# Altium schematic sheet UNO-ESP32.schdoc
size A2
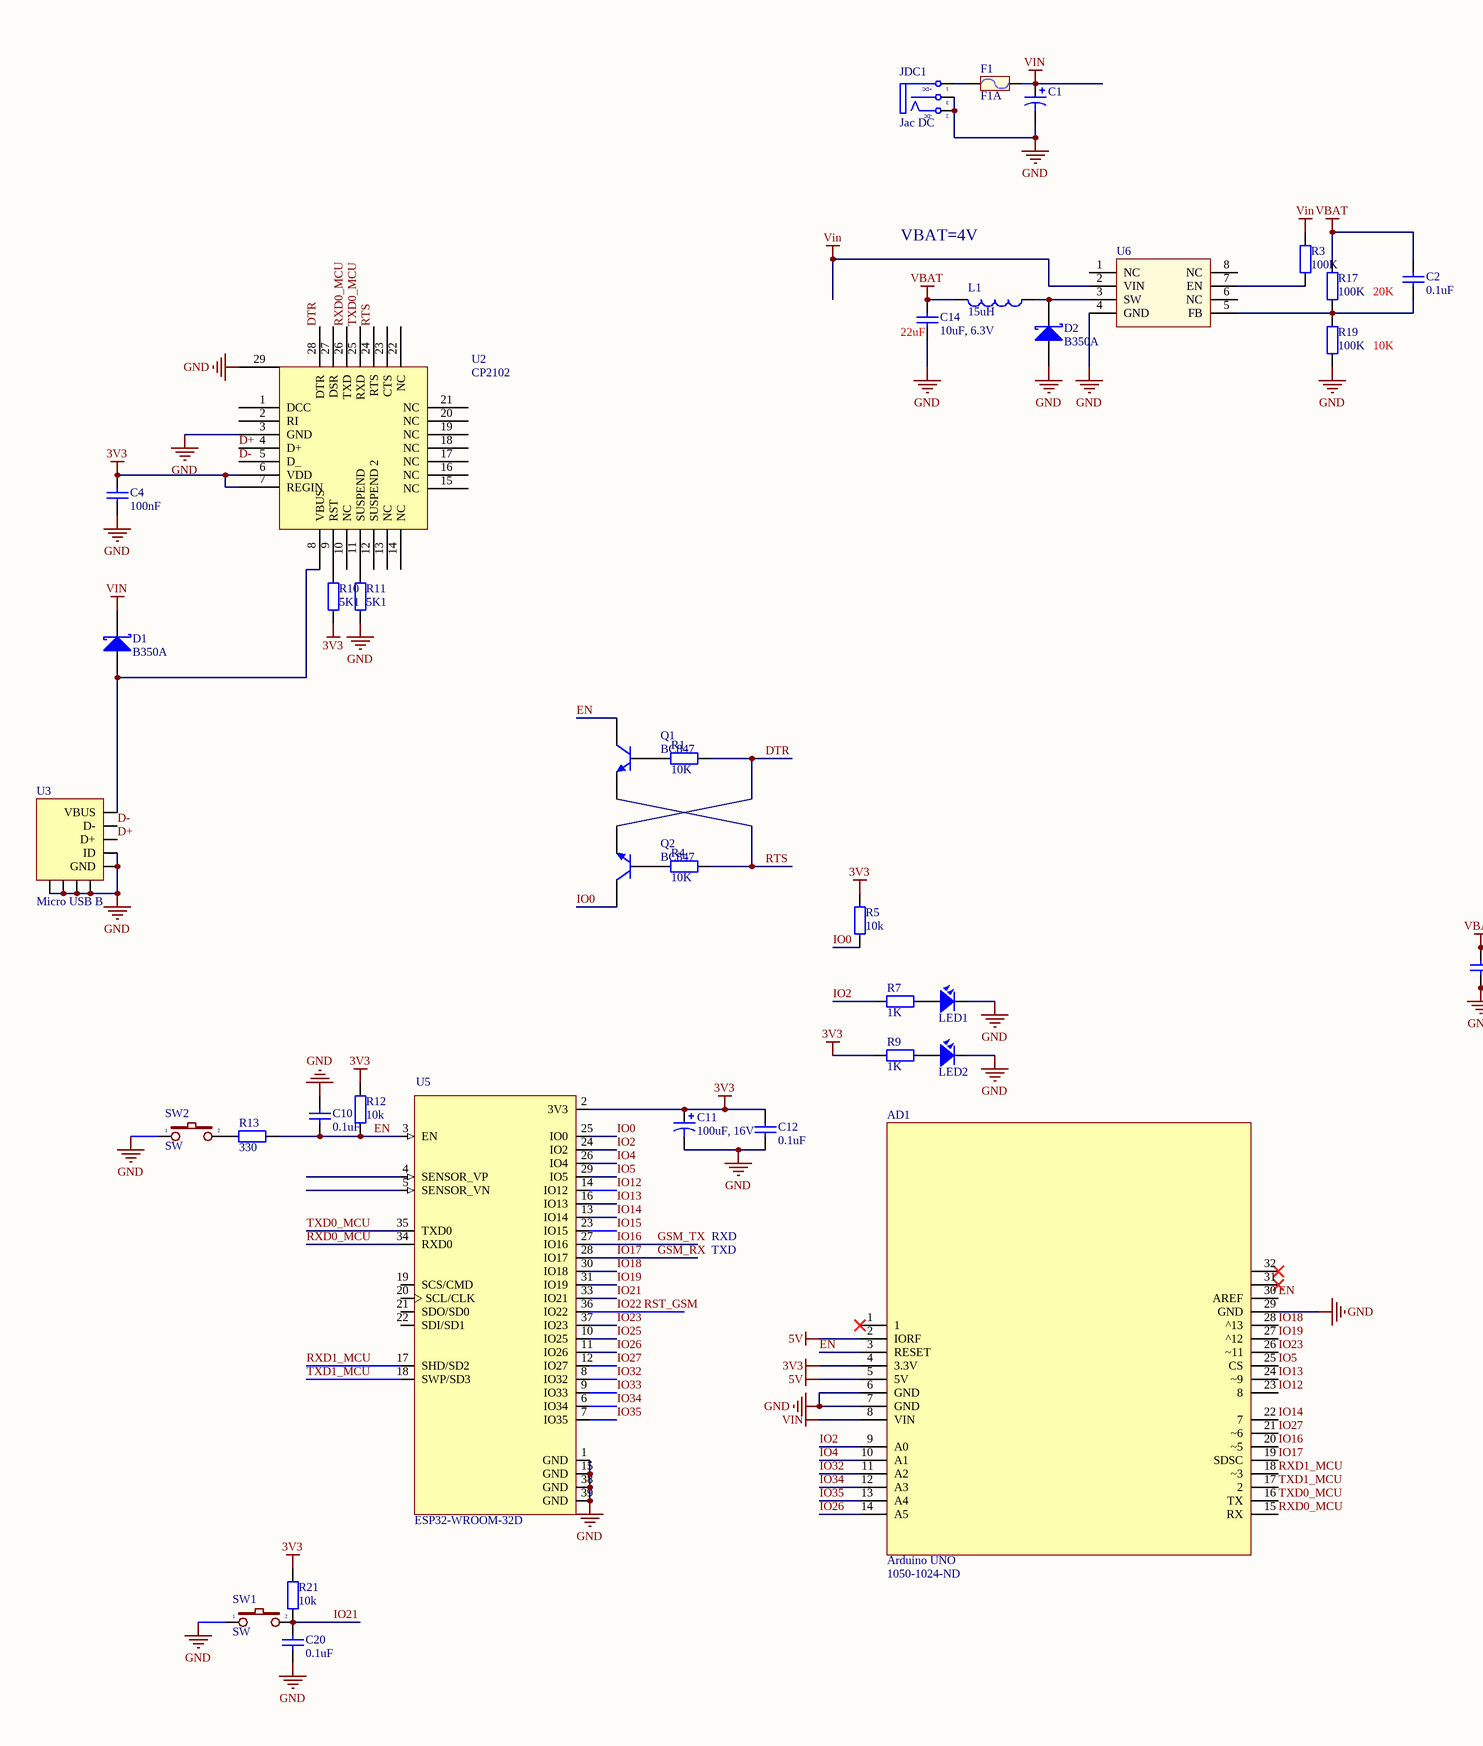
[diagram p0: UNO-ESP32.schdoc, left]
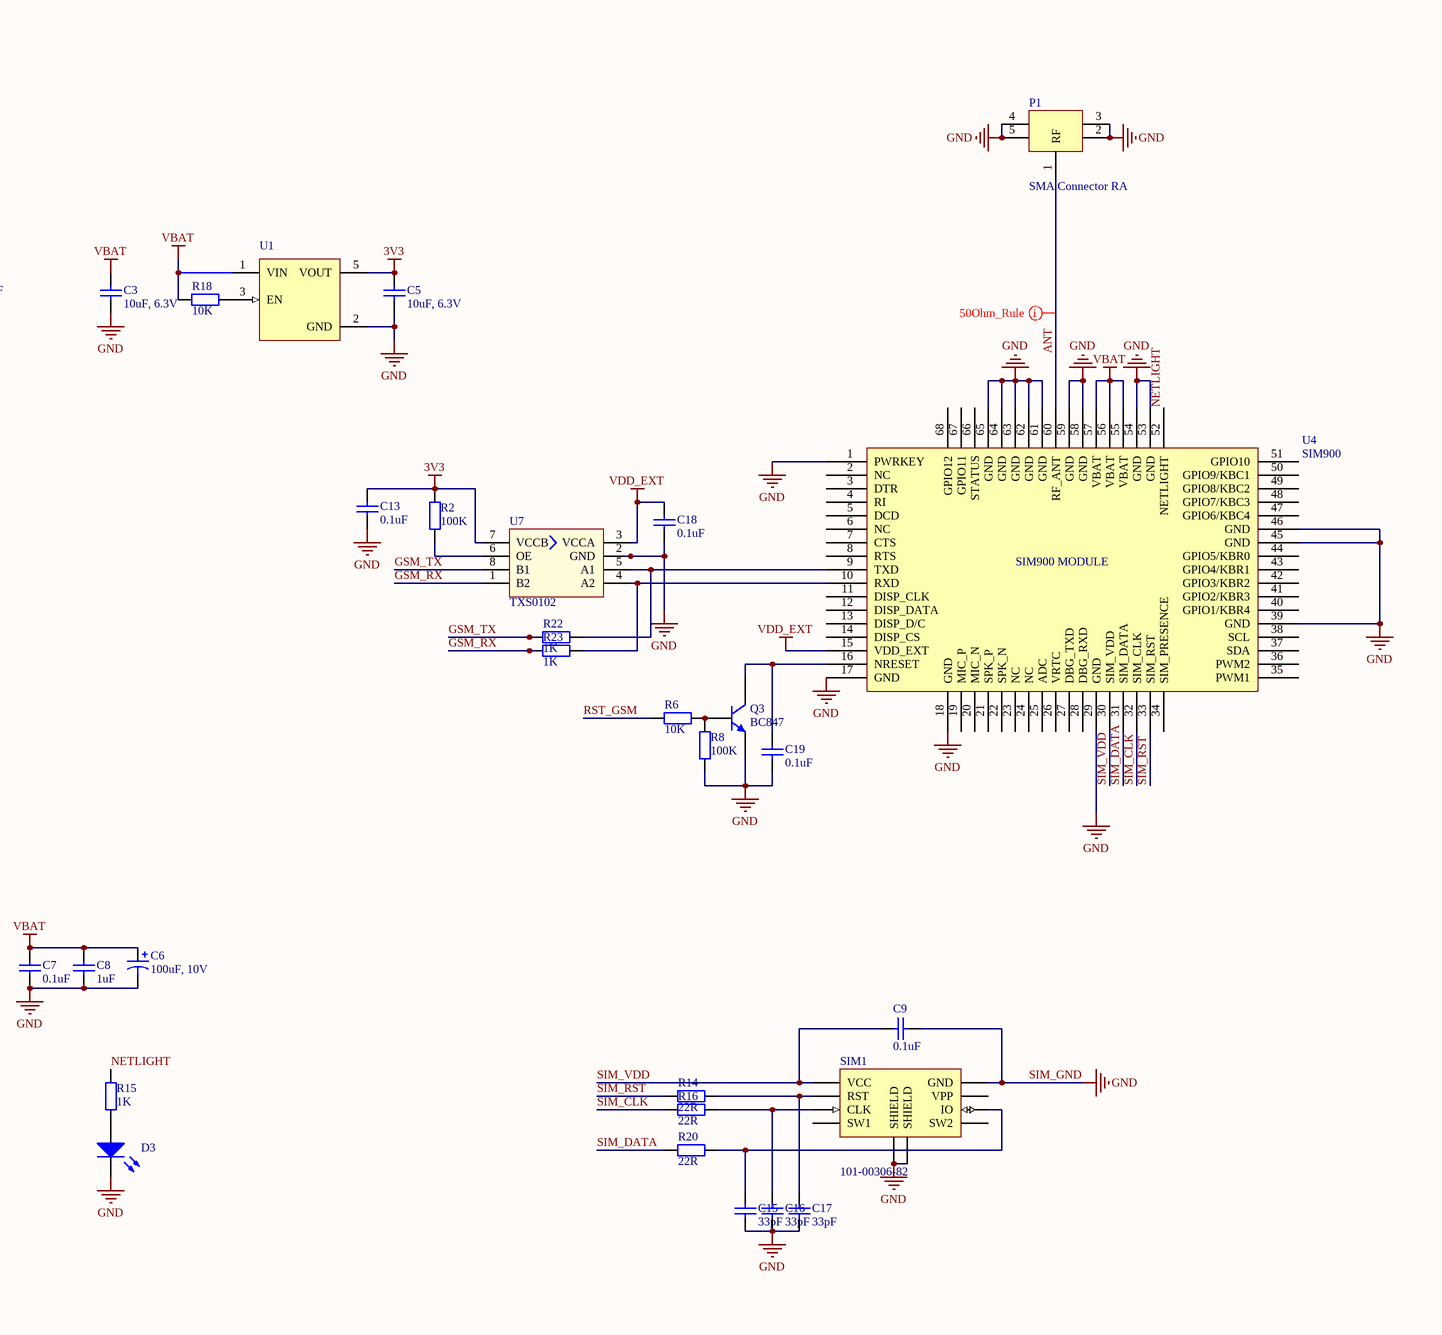
[diagram p1: UNO-ESP32.schdoc, right]

## Parts
AD1  Arduino UNO  Supplier Part Number 1: 1050-1024-ND  [Arduino UNO]
C1  Aluminum Cap 100uF 50V 20%  [CAPACITOR SIZE_E(D8.3)]  (value not drawn)
C2  value 0.1uF  [C0603]  (hidden comment: Ceramic Cap 0603 0.1uF 50V 10% X7R)
C3  value 10uF, 6.3V  [C0603]  (hidden comment: Ceramic Cap 0603 10uF 6.3V 20% X5R)
C4  value 100nF  [C0603]  (hidden comment: Ceramic Cap 0603 4.7UF  6.3V 5% NP0)
C5  value 10uF, 6.3V  [C0603]  (hidden comment: Ceramic Cap 0603 10uF 6.3V 20% X5R)
C6  value 100uF, 10V  [C2917]  (hidden comment: Tantalum Cap 2917 100uF 10V 10% 100 mOhm)
C7  value 0.1uF  [C0603]  (hidden comment: Ceramic Cap 0603 0.1uF 50V 10% X7R)
C8  value 1uF  [C0603]  (hidden comment: Ceramic Cap 0603 1uF 25V 10% X5R)
C9  value 0.1uF  [C0603]  (hidden comment: Ceramic Cap 0603 0.1uF 50V 10% X7R)
C10  value 0.1uF  [C0603]  (hidden comment: Ceramic Cap 0603 0.1uF 50V 10% X7R)
C11  value 100uF, 16V  [C2917]  (hidden comment: 100µF Molded Tantalum Capacitors 16V 2917)
C12  value 0.1uF  [C0603]  (hidden comment: Ceramic Cap 0603 0.1uF 50V 10% X7R)
C13  value 0.1uF  [C0603]  (hidden comment: Ceramic Cap 0603 0.1uF 50V 10% X7R)
C14  value 10uF, 6.3V  [C1812NP]  (hidden comment: Ceramic Cap 0603 10uF 6.3V 20% X5R)
C15  value 33pF  [C0603]  (hidden comment: Ceramic Cap 0603 33pF 50V 5% NP0)
C16  value 33pF  [C0603]  (hidden comment: Ceramic Cap 0603 33pF 50V 5% NP0)
C17  value 33pF  [C0603]  (hidden comment: Ceramic Cap 0603 33pF 50V 5% NP0)
C18  value 0.1uF  [C0603]  (hidden comment: Ceramic Cap 0603 0.1uF 50V 10% X7R)
C19  value 0.1uF  [C0603]  (hidden comment: Ceramic Cap 0603 0.1uF 50V 10% X7R)
C20  value 0.1uF  [C0603]  (hidden comment: Ceramic Cap 0603 0.1uF 50V 10% X7R)
D1  B350A  [DO-214AC]
D2  B350A  [DO-214AC]
D3  LED Green  [LED0603-G]  (value not drawn)
F1  F1A  [FUSE SMD]
JDC1  Jac DC  [DC-IN]
L1  value 15uH  [VLP8940]  (hidden comment: Inductor Shielded 15uH SMD)
LED1  LED  [LED0603-Y]  (value not drawn)
LED2  LED  [LED0603-Y]  (value not drawn)
P1  SMA Connector RA  [SMA R/A]
Q1  BC847  [SOT-23]
Q2  BC847  [SOT-23]
Q3  BC847  [SOT-23]
R1  value 10K  [R0603]  (hidden comment: RES 10K 5% 1/10W 0603)
R2  value 100K  [R0603]  (hidden comment: RES 100K 5% 1/10W 0603)
R3  value 100K  [R0603]  (hidden comment: RES 100K 5% 1/10W 0603)
R4  value 10K  [R0603]  (hidden comment: RES 10K 5% 1/10W 0603)
R5  value 10k  [R0603]  (hidden comment: RES 1K 5% 1/10W 0603)
R6  value 10K  [R0603]  (hidden comment: RES 100K 5% 1/10W 0603)
R7  value 1K  [R0603]  (hidden comment: RES 1K 5% 1/10W 0603)
R8  value 100K  [R0603]  (hidden comment: RES 100K 5% 1/10W 0603)
R9  value 1K  [R0603]  (hidden comment: RES 1K 5% 1/10W 0603)
R10  value 5K1  [R0603]  (hidden comment: RES 1K 5% 1/10W 0603)
R11  value 5K1  [R0603]  (hidden comment: RES 1K 5% 1/10W 0603)
R12  value 10k  [R0603]  (hidden comment: RES 1K 5% 1/10W 0603)
R13  value 330  [R0603]  (hidden comment: RES 1K 5% 1/10W 0603)
R14  value 22R  [R0603]  (hidden comment: RES 22R 5% 1/10W 0603)
R15  value 1K  [R0603]  (hidden comment: RES 1K 5% 1/10W 0603)
R16  value 22R  [R0603]  (hidden comment: RES 22R 5% 1/10W 0603)
R17  value 100K  [R0603]  (hidden comment: RES 100K 5% 1/10W 0603)
R18  value 10K  [R0603]  (hidden comment: RES 100K 5% 1/10W 0603)
R19  value 100K  [R0603]  (hidden comment: RES 100K 5% 1/10W 0603)
R20  value 22R  [R0603]  (hidden comment: RES 22R 5% 1/10W 0603)
R21  value 10k  [R0603]  (hidden comment: RES 1K 5% 1/10W 0603)
R22  value 1K  [R0603]  (hidden comment: RES 1K 5% 1/10W 0603)
R23  value 1K  [R0603]  (hidden comment: RES 1K 5% 1/10W 0603)
SIM1  value 101-00306-82  [nano-sim]  (hidden comment: SIM Card Holder)
SW1  SW  [SW-smd]
SW2  SW  [SW-smd]
U1  AP2112K-3.3TRG1  [SOT-23-5]  (value not drawn)
U2  CP2102  [CP2102]
U3  Micro USB B  [USB Micro B - DIP]
U4  SIM900  [SIM900]
U5  ESP32-WROOM-32D  [*MODULE_ESP32-WROOM-32D]
U6  TD1410  [SO-8]  (value not drawn)
U7  TXS0102  [TXS0102]

## Nets
3V3: AD1.4(3.3V) C4.1 C5.2 C11.1 C12.2 C13.2 R2.2 R5.1 R9.1 R10.1 R12.1 R21.1 U1.5(VOUT) U2.6(VDD) U2.7(REGIN) U5.2(3V3) U7.7(VCCB)
5V: AD1.2(IORF) AD1.5(5V)
SIM_GND: AD1.6(GND) AD1.7(GND) AD1.29(GND) C1.2 C3.1 C4.2 C5.1 C6.2 C7.1 C8.1 C9.1 C10.2 C11.2 C12.1 C13.1 C14.1 C15.1 C16.1 C17.1 C18.1 C19.1 C20.1 D2.1(A) D3.2(K) JDC1.2(TN) JDC1.3(S) LED1.2 LED2.2 P1.2(GND) P1.3(GND) P1.4(GND) P1.5(GND) Q3.2(E) R8.1 R11.1 R19.1 SIM1.C5(GND) SIM1.SHIELD SW1.1 SW2.1 U1.2(GND) U2.3(GND) U2.29 U3.4(ID) U3.5(GND) U3.SHIELD U4.1(PWRKEY) U4.17(GND) U4.18(GND) U4.29(GND) U4.39(GND) U4.45(GND) U4.46(GND) U4.53(GND) U4.54(GND) U4.58(GND) U4.59(GND) U4.61(GND) U4.62(GND) U4.63(GND) U4.64(GND) U4.65(GND) U5.1(GND) U5.15(GND) U5.38(GND) U5.39(GND) U6.4(GND) U7.2(GND)  [also labelled GND]
VBAT: C2.2 C3.2 C6.1 C7.2 C8.2 C14.2 L1.1 R17.2 R18.1 U1.1(VIN) U4.55(VBAT) U4.56(VBAT) U4.57(VBAT)
VDD_EXT: C18.2 U4.15(VDD_EXT) U7.3(VCCA)
VIN: AD1.8(VIN) C1.1 D1.2(K) F1.2 R3.2 U6.2(VIN)
ANT: P1.1(RF) U4.60(RF_ANT)
D+: U2.4(D+) U3.3(D+)
D-: U2.5(D_) U3.2(D-)
DTR: Q2.2(E) R1.1 U2.28(DTR)
EN: AD1.3(RESET) AD1.30(AREF) C10.1 Q1.3(C) R12.2 R13.2 U5.3(EN)
GSM_RX: AD1.19(SDSC) R23.1 U5.28(IO17) U7.1(B2)  [also labelled IO17]
GSM_TX: AD1.20(~5) R22.1 U5.27(IO16) U7.8(B1)  [also labelled IO16]
IO0: Q2.3(C) R5.2 U5.25(IO0)
IO2: AD1.9(A0) R7.1 U5.24(IO2)
IO4: AD1.10(A1) U5.26(IO4)
IO5: AD1.25(CS) U5.29(IO5)
IO12: AD1.23(8) U5.14(IO12)
IO13: AD1.24(~9) U5.16(IO13)
IO14: AD1.22(7) U5.13(IO14)
IO15: U5.23(IO15)
IO18: AD1.28(^13) U5.30(IO18)
IO19: AD1.27(^12) U5.31(IO19)
IO21: C20.2 R21.2 SW1.2 U5.33(IO21)
IO22: R6.1 U5.36(IO22)  [also labelled RST_GSM]
IO23: AD1.26(~11) U5.37(IO23)
IO25: U5.10(IO25)
IO26: AD1.14(A5) U5.11(IO26)
IO27: AD1.21(~6) U5.12(IO27)
IO32: AD1.11(A2) U5.8(IO32)
IO33: U5.9(IO33)
IO34: AD1.12(A3) U5.6(IO34)
IO35: AD1.13(A4) U5.7(IO35)
NETLIGHT: R15.2 U4.52(NETLIGHT)
RTS: Q1.2(E) R4.1 U2.24(RTS)
RXD0_MCU: AD1.15(RX) U2.26(TXD) U5.34(RXD0)
RXD1_MCU: AD1.18(~3) U5.17(SHD/SD2)
SIM_CLK: R16.1 U4.32(SIM_CLK)
SIM_DATA: R20.1 U4.31(SIM_DATA)
SIM_RST: R14.1 U4.33(SIM_RST)
SIM_VDD: C9.2 SIM1.C1(VCC) U4.30(SIM_VDD)
TXD0_MCU: AD1.16(TX) U2.25(RXD) U5.35(TXD0)
TXD1_MCU: AD1.17(2) U5.18(SWP/SD3)
NetC2_1: C2.1 R17.1 R19.2 U6.5(FB)
NetC15_2: C15.2 R20.2 SIM1.C7(IO)
NetC16_2: C16.2 R16.2 SIM1.C3(CLK)
NetC17_2: C17.2 R14.2 SIM1.C2(RST)
NetC19_2: C19.2 Q3.3(C) U4.16(NRESET)
NetD1_1: D1.1(A) U2.8(VBUS) U3.1(VBUS)
NetD2_2: D2.2(K) L1.2 U6.3(SW)
NetD3_1: D3.1(A) R15.1
NetF1_1: F1.1 JDC1.1(T)
NetLED1_1: LED1.1 R7.2
NetLED2_1: LED2.1 R9.2
NetQ1_1: Q1.1(B) R1.2
NetQ2_1: Q2.1(B) R4.2
NetQ3_1: Q3.1(B) R6.2 R8.2
NetR2_1: R2.1 U7.6(OE)
NetR3_1: R3.1 U6.7(EN)
NetR10_2: R10.2 U2.9(RST)
NetR11_2: R11.2 U2.11(SUSPEND)
NetR13_1: R13.1 SW2.2
NetR18_2: R18.2 U1.3(EN)
NetR22_2: R22.2 U4.9(TXD) U7.5(A1)
NetR23_2: R23.2 U4.10(RXD) U7.4(A2)

Not connected (* = marked no-connect by the designer): AD1 1* 31* 32*; SIM1 C6(VPP) SW1 SW2; U2 1(DCC) 2(RI) 10(NC) 12(SUSPEND_2) 13(NC) 14(NC) 15(NC) 16(NC) 17(NC) 18(NC) 19(NC) 20(NC) 21(NC) 22(NC) 23(CTS) 27(DSR); U4 2(NC) 3(DTR) 4(RI) 5(DCD) 6(NC) 7(CTS) 8(RTS) 11(DISP_CLK) 12(DISP_DATA) 13(DISP_D/C) 14(DISP_CS) 19(MIC_P) 20(MIC_N) 21(SPK_P) 22(SPK_N) 23(NC) 24(NC) 25(ADC) 26(VRTC) 27(DBG_TXD) 28(DBG_RXD) 34(SIM_PRESENCE) 35(PWM1) 36(PWM2) 37(SDA) 38(SCL) 40(GPIO1/KBR4) 41(GPIO2/KBR3) 42(GPIO3/KBR2) 43(GPIO4/KBR1) 44(GPIO5/KBR0) 47(GPIO6/KBC4) 48(GPIO7/KBC3) 49(GPIO8/KBC2) 50(GPIO9/KBC1) 51(GPIO10) 66(STATUS) 67(GPIO11) 68(GPIO12); U5 4(SENSOR_VP) 5(SENSOR_VN) 19(SCS/CMD) 20(SCL/CLK) 21(SDO/SD0) 22(SDI/SD1); U6 1(NC) 6(NC) 8(NC)

## Layout directives
rule Width Constraint [Pref Width = 26mil    Min Width = 26mil    Max Width = 26mil]; rule Clearance Constraint [Clearance = 10mil]: ANT

## Notes on the sheet
- VBAT=4V
- (near C2) 20K
- (near C14) 22uF
- 10K
- RXD
- TXD
- (in symbol DCIN) +DC; -DC
- (in symbol SIM900) SIM900 MODULE

## Library data of the parts
C1 = 50ZLJ100MT78X11.5: Rubicon Aluminum Cap 100uF 50V 20%; Supplier Part Number 1: 1189-1662-1-ND; Supplier 1: Digi-Key
C2 C7 C9 C10 C12 C13 C18-C20 = GRM188R71H104KA93: Murata General Purpose Ceramic Cap 0603 0.1uF 50V 10% X7R; Supplier 1: Digi-Key; Supplier Part Number 1: 490-1519-1-ND
C3 C5 C14 = GRM188R60J106ME47: Murata General Purpose Ceramic Cap 0603 10uF 6.3V 20% X5R; Supplier 1: Digi-Key; Supplier Part Number 1: 490-3896-1-ND
C4 = GRM188R61C475KAAJD: CAP CER 4.7UF 6.3V X6S 0603; Supplier 1: Digi-Key; Supplier Part Number 1: 490-10481-2-ND
C6 = TPSD107K010R0100: AVX Tantalum Cap 2917 100uF 10V 10% 100 mOhm; Supplier 1: Digi-Key; Supplier Part Number 1: 478-1777-1-ND
C8 = GRM188R61E105KA12: Murata General Purpose Ceramic Cap 0603 1uF 25V 10% X5R; Supplier 1: Digi-Key; Supplier 2: Digi-Key; Supplier Part Number 1: 490-6414-1-ND; Supplier Part Number 2: 490-3897-1-ND
C11 = TAJD107M016RNJ: 100µF Molded Tantalum Capacitors 16V 2917 (7343 Metric) 600 mOhm 0.287" L x 0.169" W (7.30mm x 4.30mm); Supplier 1: Digi-Key; Supplier Part Number 1: 478-3919-2-ND
C15-C17 = GRM1885C1H330JA01: Murata General Purpose Ceramic Cap 0603 33pF 50V 5% NP0; Supplier 1: Digi-Key; Supplier Part Number 1: 490-1415-1-ND
D1 D2 = B350A: Schottky Diode 50V 3A SMA; Supplier 1: Digi-Key; Supplier Part Number 1: B350A-FDICT-ND; Value: B350A
D3 = LTST-C190KGKT: Lite-On LED Green 0603; Supplier Part Number 1: 160-1435-1-ND; Supplier 1: Digi-Key; Value: LED Green
F1 = Fuse: Designed by: VanDungEvn; Value: Fuse
JDC1 = DCIN: Jac DC input; Value: Jac DC
L1 = DR127-150-R: Supplier Part Number 1: 513-1040-1-ND; Supplier 1: Digi-Key
LED1 LED2 = LED SMD: Value: LED 3 - 5 ly 2 Colour
Q1-Q3 = BC847: TRANS BIPO NPN 200MW 45V SC70-3; Supplier Part Number 1: BC847AW-7FDICT-ND; Supplier 1: Digi-Key; Value: BC847
R1 R4 = RC0603JR-0710KL: Yageo RES 10K 5% 1/10W 0603; Supplier 1: Digi-Key; Supplier Part Number 1: 311-10KGRCT-ND
R2 R3 R6 R8 R17-R19 = RC0603JR-07100KL: Yageo RES 100K 5% 1/10W 0603; Supplier 1: Digi-Key; Supplier Part Number 1: 311-100KGRCT-ND; Supplier Part Number 2: FL2402
R5 R7 R9-R13 R15 R21-R23 = RC0603JR-071KL: Yageo RES 1K 5% 1/10W 0603; Supplier 1: Digi-Key; Supplier Part Number 1: 311-1.0KGRCT-ND
R14 R16 R20 = RC0603JR-0722RL: Yageo RES 22R 5% 1/10W 0603; Supplier 1: Digi-Key; Supplier Part Number 1: 311-22GRCT-ND
SIM1 = 101-00306-82: Amphenol SIM Card Holder; Supplier 1: Digi-Key; Supplier Part Number 1: 101-00306-82-1-ND
SW1 SW2 = SW2: Switch button 2 pin; Value: SW chip 2 pin
U1 = AP2112K-3.3TRG1: AP2112 Series 0.6 A 3.3 V Fixed Output SMT LDO Linear Regulator - SOT23-5; MF: Diodes Inc.; Availability: Unavailable; Package: SOT-753 Diodes Inc.; Price: None; SnapEDA_Link: https://www.snapeda.com/parts/AP2112K-3.3TRG1/Diodes%20Inc./view-part/?ref=snap; MP: AP2112K-3.3TRG1; Value: *
U3 = 0473460001: Molex Micro USB B Receptacle Right Angle; Supplier 1: Digi-Key; Supplier Part Number 1: WM17141CT-ND; Value: Micro USB B
U4 = SIM900: SIM900 GSM MODULE
U5 = ESP32-WROOM-32D: IC: SoC; GPIO, I2C, I2S, IR, SD, SDIO, SPI, UART; 2.7Ã·3.6VDC; 20dBm; MF: Espressif Systems; Price: None; MP: ESP32-WROOM-32D; SnapEDA_Link: https://www.snapeda.com/parts/ESP32-WROOM-32D/Espressif%20Systems/view-part/?ref=snap; Availability: Unavailable; Package: Module Espressif Systems; Value: *
U6 = TD1410: 2A 380KHz 20V PWM Buck DC/DC Converter
U7 = TXS0102: TXS0102 2-Bit Bidirectional Voltage-Level Translator for Open-Drain and Push-Pull / Applications; Supplier 1: Newark; Supplier Part Number 1: 12X9070
AD1 = Arduino UNO: Supplier 1: Digi-Key